# EAGLE design schema_8relay (EAGLE 7.3.0)
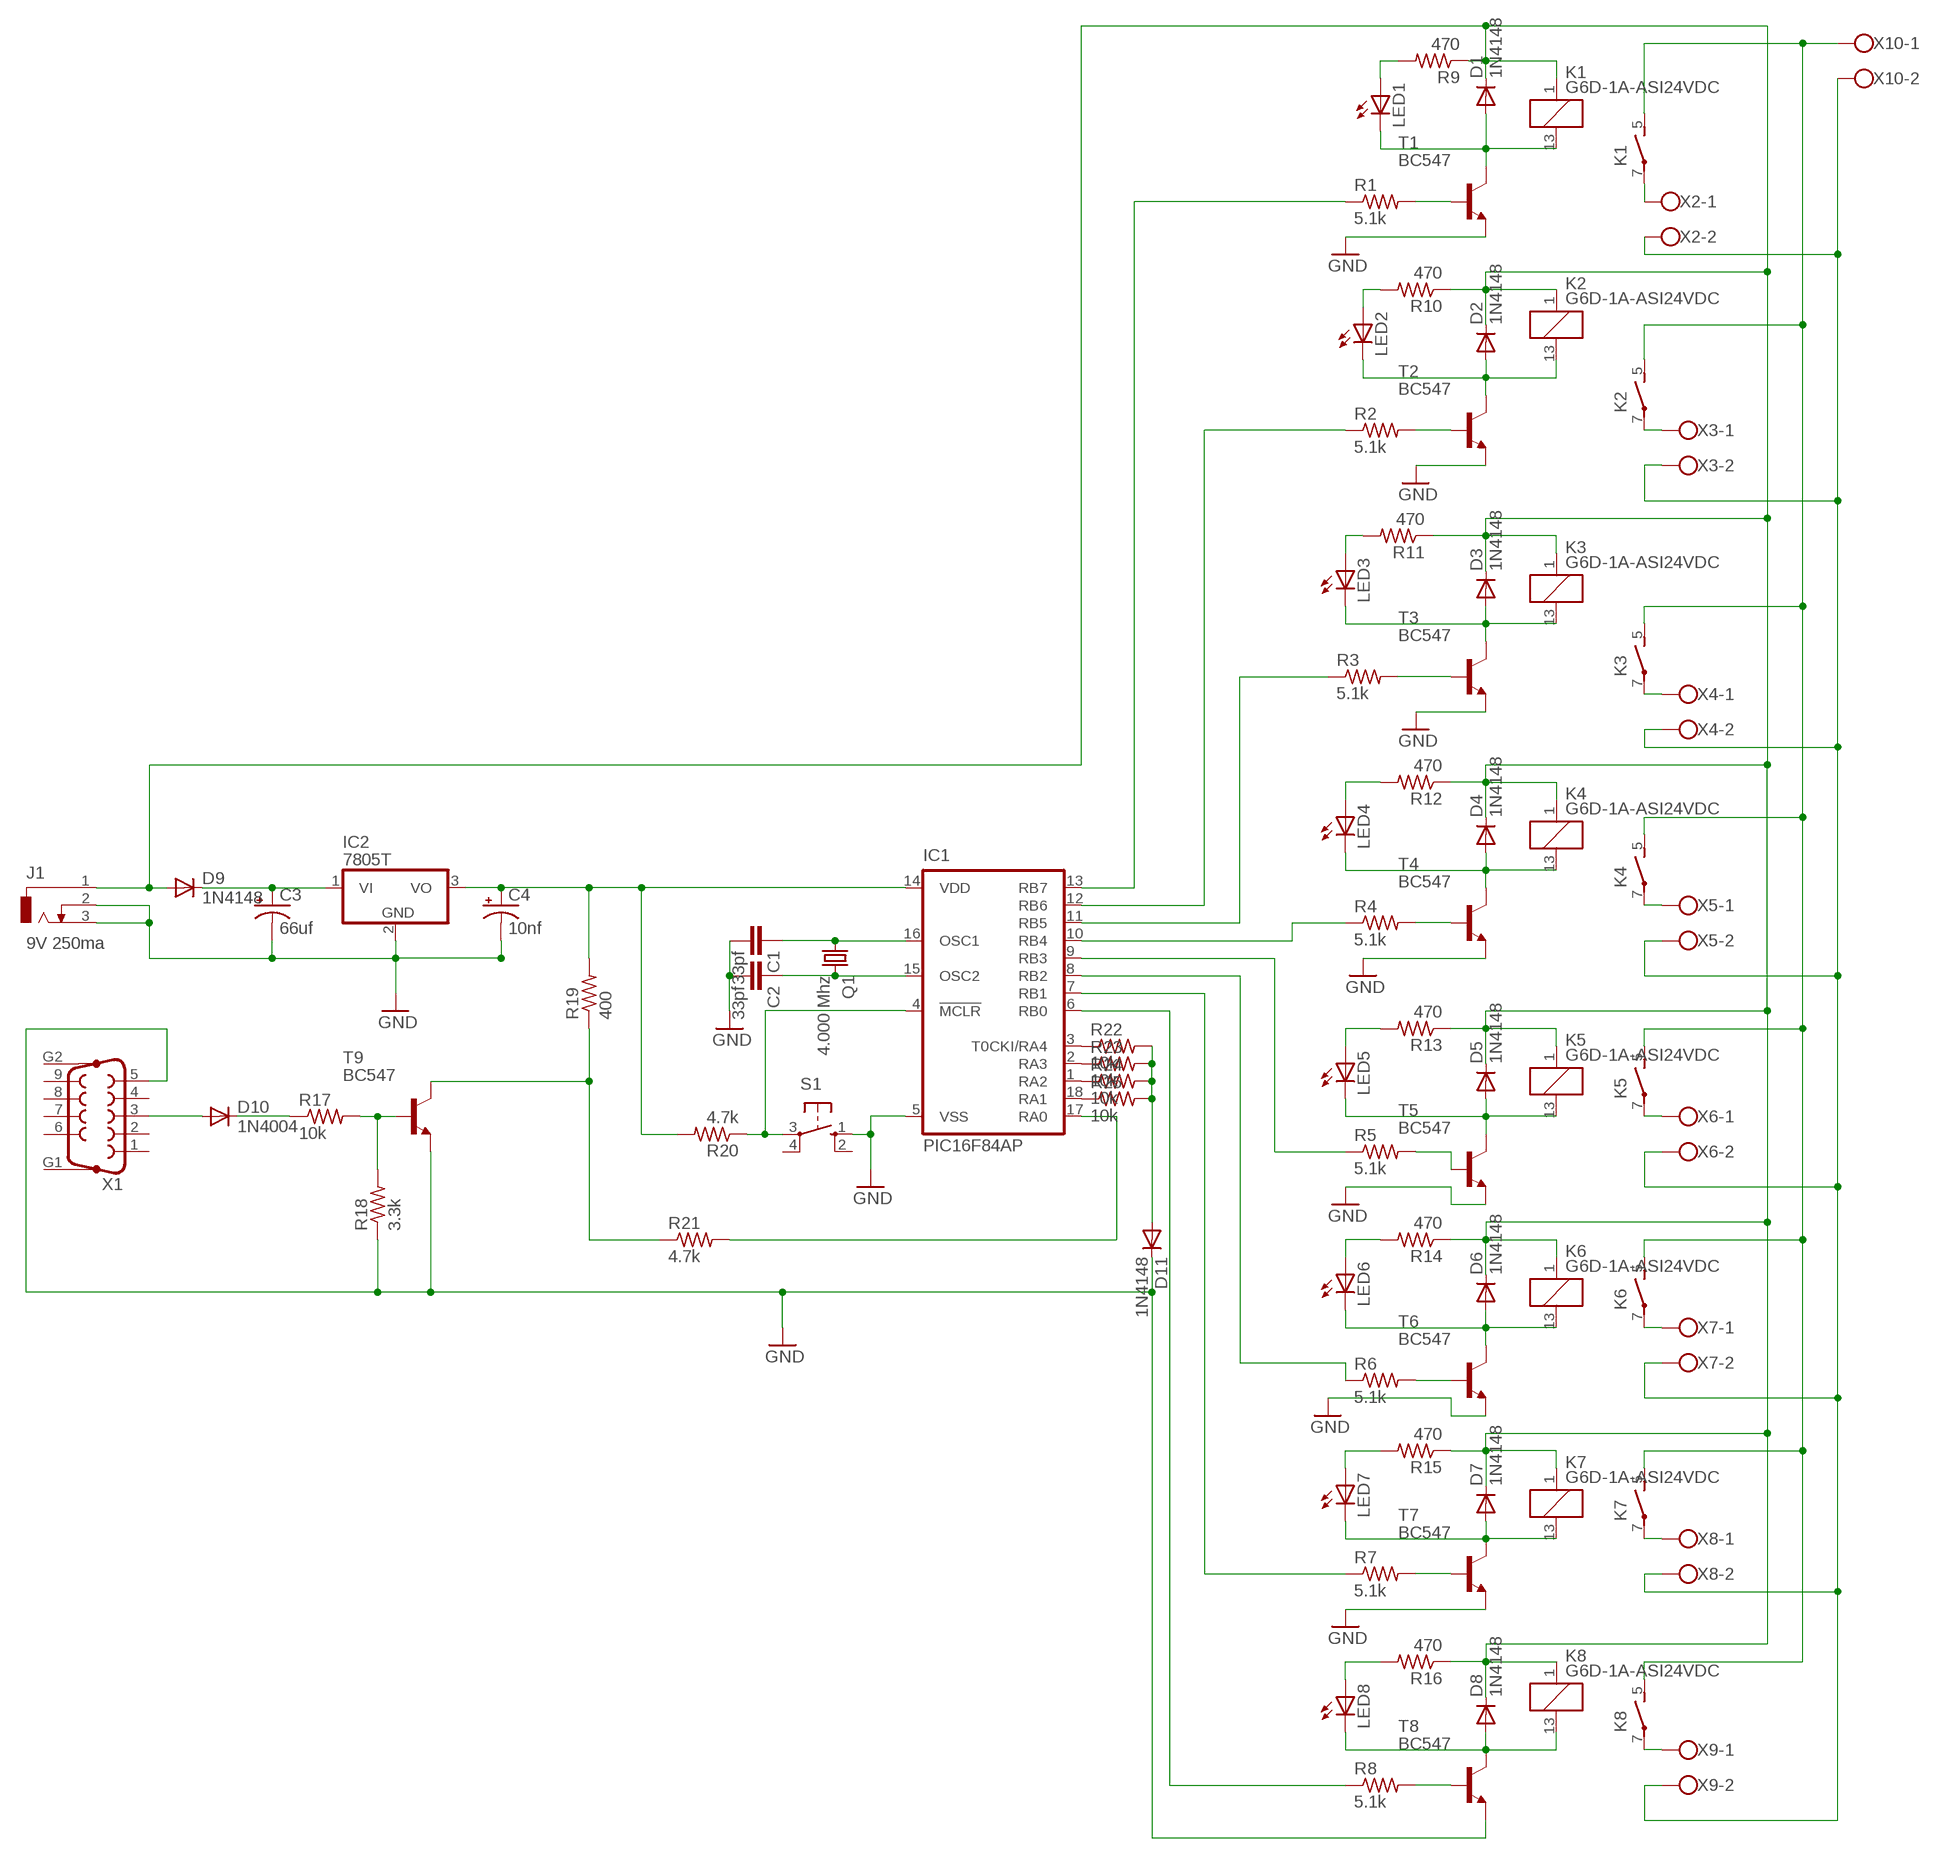
[diagram p0: schematic, sheet 1]

## Parts
C1  33pf  C-EU050-024X044  [C050-024X044]
C2  33pf  C-EU050-024X044  [C050-024X044]
C3  66uf  CPOL-USE2.5-6  [E2,5-6]
C4  10nf  CPOL-USE2.5-6  [E2,5-6]
D1  1N4148  [DO35-10]
D2  1N4148  [DO35-10]
D3  1N4148  [DO35-10]
D4  1N4148  [DO35-10]
D5  1N4148  [DO35-10]
D6  1N4148  [DO35-10]
D7  1N4148  [DO35-10]
D8  1N4148  [DO35-10]
D9  1N4148  [DO35-10]
D10  1N4004  [DO41-10]
D11  1N4148  [DO35-10]
IC1  PIC16F84AP  [DIL18]
IC2  7805T  [TO220H]
J1  9V 250ma  DCJ0303  [DCJ0303]
K1  G6D-1A-ASI24VDC  [G6D]
K2  G6D-1A-ASI24VDC  [G6D]
K3  G6D-1A-ASI24VDC  [G6D]
K4  G6D-1A-ASI24VDC  [G6D]
K5  G6D-1A-ASI24VDC  [G6D]
K6  G6D-1A-ASI24VDC  [G6D]
K7  G6D-1A-ASI24VDC  [G6D]
K8  G6D-1A-ASI24VDC  [G6D]
LED1  LED3MM  [LED3MM]
LED2  LED3MM  [LED3MM]
LED3  LED3MM  [LED3MM]
LED4  LED3MM  [LED3MM]
LED5  LED3MM  [LED3MM]
LED6  LED3MM  [LED3MM]
LED7  LED3MM  [LED3MM]
LED8  LED3MM  [LED3MM]
Q1  4.000 Mhz  CRYSTALHC49U70  [HC49U70]
R1  5.1k  R-US_0204/7  [0204/7]
R2  5.1k  R-US_0204/7  [0204/7]
R3  5.1k  R-US_0204/7  [0204/7]
R4  5.1k  R-US_0204/7  [0204/7]
R5  5.1k  R-US_0204/7  [0204/7]
R6  5.1k  R-US_0204/7  [0204/7]
R7  5.1k  R-US_0204/7  [0204/7]
R8  5.1k  R-US_0204/7  [0204/7]
R9  470  R-US_0204/7  [0204/7]
R10  470  R-US_0204/7  [0204/7]
R11  470  R-US_0204/7  [0204/7]
R12  470  R-US_0204/7  [0204/7]
R13  470  R-US_0204/7  [0204/7]
R14  470  R-US_0204/7  [0204/7]
R15  470  R-US_0204/7  [0204/7]
R16  470  R-US_0204/7  [0204/7]
R17  10k  R-US_0204/7  [0204/7]
R18  3.3k  R-US_0204/7  [0204/7]
R19  400  R-US_0207/12  [0207/12]
R20  4.7k  R-US_0204/7  [0204/7]
R21  4.7k  R-US_0204/7  [0204/7]
R22  10k  R-US_0204/7  [0204/7]
R23  10k  R-US_0204/7  [0204/7]
R24  10k  R-US_0204/7  [0204/7]
R25  10k  R-US_0204/7  [0204/7]
S1  10-XX  [B3F-10XX]
T1  BC547  [TO92]
T2  BC547  [TO92]
T3  BC547  [TO92]
T4  BC547  [TO92]
T5  BC547  [TO92]
T6  BC547  [TO92]
T7  BC547  [TO92]
T8  BC547  [TO92]
T9  BC547  [TO92]
X1  F09HP  [F09HP]
X2  W237-102  [W237-102]
X3  W237-102  [W237-102]
X4  W237-102  [W237-102]
X5  W237-102  [W237-102]
X6  W237-102  [W237-102]
X7  W237-102  [W237-102]
X8  W237-102  [W237-102]
X9  W237-102  [W237-102]
X10  W237-102  [W237-102]

## Nets
GND: C1.2 C2.2 C3.- C4.- D11.C IC1.5(VSS) IC2.2(GND) J1.2 J1.3 R18.1 S1.1(S) T1.1(E) T2.1(E) T3.1(E) T4.1(E) T5.1(E) T6.1(E) T7.1(E) T8.1(E) T9.1(E) X1.5
N$1: C1.1 IC1.16(OSC1) Q1.1
N$2: C2.1 IC1.15(OSC2) Q1.2
N$3: R19.1 R21.1 T9.3(C)
N$4: D1.A K1.13 LED1.K(C) T1.3(C)
N$5: R1.2 T1.2(B)
N$6: D2.A K2.13 LED2.K(C) T2.3(C)
N$7: IC1.17(RA0) R21.2
N$8: IC1.4(!MCLR) R20.1 S1.3(P)
N$9: D10.A X1.3
N$10: D10.C R17.1
N$11: R17.2 R18.2 T9.2(B)
N$12: C4.+ IC1.14(VDD) IC2.3(VO) R19.2 R20.2
N$13: IC1.13(RB7) R1.1
N$14: K1.7(2:P) X2.1
N$15: R2.2 T2.2(B)
N$16: LED2.A R10.2
N$17: D4.A K4.13 LED4.K(C) T4.3(C)
N$18: D6.A K6.13 LED6.K(C) T6.3(C)
N$19: LED4.A R12.2
N$20: K2.7(2:P) X3.1
N$21: IC1.10(RB4) R4.1
N$22: R3.2 T3.2(B)
N$23: R5.2 T5.2(B)
N$24: LED5.A R13.2
N$25: K3.7(2:P) X4.1
N$26: IC1.9(RB3) R5.1
N$27: R4.2 T4.2(B)
N$28: LED6.A R14.2
N$29: LED3.A R11.2
N$30: K4.7(2:P) X5.1
N$31: K1.5(2:S) K2.5(2:S) K3.5(2:S) K4.5(2:S) K5.5(2:S) K6.5(2:S) K7.5(2:S) K8.5(2:S) X10.1
N$34: C3.+ D9.C IC2.1(VI)
N$35: K5.7(2:P) X6.1
N$36: IC1.3(T0CKI/RA4) R22.1
N$37: R6.2 T6.2(B)
N$39: IC1.2(RA3) R23.1
N$40: K6.7(2:P) X7.1
N$41: IC1.1(RA2) R24.1
N$42: R7.2 T7.2(B)
N$43: D7.A K7.13 LED7.K(C) T7.3(C)
N$44: IC1.18(RA1) R25.1
N$45: K7.7(2:P) X8.1
N$46: D5.A K5.13 LED5.K(C) T5.3(C)
N$47: R8.2 T8.2(B)
N$48: LED8.A R16.2
N$49: LED7.A R15.2
N$50: K8.7(2:P) X9.1
N$52: IC1.6(RB0) R8.1
N$53: IC1.7(RB1) R7.1
N$54: IC1.8(RB2) R6.1
N$55: D8.A K8.13 LED8.K(C) T8.3(C)
N$56: LED1.A R9.2
N$57: IC1.11(RB5) R3.1
N$58: IC1.12(RB6) R2.1
N$62: X2.2 X3.2 X4.2 X5.2 X6.2 X7.2 X8.2 X9.2 X10.2
N$64: D1.C D2.C D3.C D4.C D5.C D6.C D7.C D8.C D9.A J1.1 K1.1 K2.1 K3.1 K4.1 K5.1 K6.1 K7.1 K8.1 R9.1 R10.1 R11.1 R12.1 R13.1 R14.1 R15.1 R16.1
N$69: D3.A K3.13 LED3.K(C) T3.3(C)
N$74: D11.A R22.2 R23.2 R24.2 R25.2
Unconnected: S1.2(S1) S1.4(P1) X1.1 X1.2 X1.4 X1.6 X1.7 X1.8 X1.9 X1.G1 X1.G2

## Library data of the parts
C1 C2 = rcl:C-EU: CAPACITOR, European symbol
C3 C4 = rcl:CPOL-US: POLARIZED CAPACITOR, American symbol
D1-D9 D11 = diode:1N4148: DIODE high speed (Philips)
D10 = diode:1N4004: DIODE general purpose rectifier, 1 A
IC1 = microchip:PIC16F8*: MICROCONTROLLER 8-Bit PIC16F8X Family - CMOS Flash/EEPROM Pin Compatible : PIC16F83, PIC16CR83, PIC16F84A, PIC16CR84 see also PIC16C*
IC2 = linear:78*: Positive VOLTAGE REGULATOR Source: http://cache.national.com/ds/LM/LM78L05.pdf http://www.fairchildsemi.com/ds/LM/LM7805.pdf
J1 = con-jack:DCJ0303: DC POWER JACK Source: DCJ0303.pdf
K1-K8 = relay:G6D?*: OMRON Slim, Miniature PCB Relay 17.5 × 6.5 × 12.5 mm with Socked Source: http://ecb.omron.com.sg/pdf/relay/power/G6D.pdf
LED1-LED8 = led:LED: LED OSRAM: - CHIPLED LG R971, LG N971, LY N971, LG Q971, LY Q971, LO R971, LY R971 LH N974, LH R974 LS Q976, LO Q976, LY Q976 LO Q996 - Hyper CHIPLED LW Q18S LB Q993, LB Q99A, LB R99A - SideLED LS A670, LO A670, LY A670, LG A670, LP A670 LB A673, LV A673, LT A673, LW A673 LH A674 LY A675 LS A676, LA A676, LO A676, LY A676, LW A676 LS A679, LY A679, LG A679 - Hyper Micro SIDELED® LS Y876, LA Y876, LO Y876, LY Y876 LT Y87S - SmartLED LW L88C, LW L88S LB L89C, LB L89S, LG L890 LS L89K, LO L89K, LY L89K LS L896, LA L896, LO L896, LY L896 - TOPLED LS T670, LO T670, LY T670, LG T670, LP T670 LSG T670, LSP T670, LSY T670, LOP T670, LYG T670 LG T671, LOG T671, LSG T671 LB T673, LV T673, LT T673, LW T673 LH T674 LS T676, LA T676, LO T676, LY T676, LB T676, LH T676, LSB T676, LW T676 LB T67C, LV T67C, LT T67C, LS T67K, LO T67K, LY T67K, LW E67C LS E67B, LA E67B, LO E67B, LY E67B, LB E67C, LV E67C, LT E67C LW T67C LS T679, LY T679, LG T679 LS T770, LO T770, LY T770, LG T770, LP T770 LB T773, LV T773, LT T773, LW T773 LH T774 LS E675, LA E675, LY E675, LS T675 LS T776, LA T776, LO T776, LY T776, LB T776 LHGB T686 LT T68C, LB T68C - Hyper Mini TOPLED® LB M676 - Mini TOPLED Santana® LG M470 LS M47K, LO M47K, LY M47K Source: http://www.osram.convergy.de - LUMILED® LXK2-PW12-R00, LXK2-PW12-S00, LXK2-PW14-U00, LXK2-PW14-V00 LXK2-PM12-R00, LXK2-PM12-S00, LXK2-PM14-U00 LXK2-PE12-Q00, LXK2-PE12-R00, LXK2-PE12-S00, LXK2-PE14-T00, LXK2-PE14-U00 LXK2-PB12-K00, LXK2-PB12-L00, LXK2-PB12-M00, LXK2-PB14-N00, LXK2-PB14-P00, LXK2-PB14-Q00 LXK2-PR12-L00, LXK2-PR12-M00, LXK2-PR14-Q00, LXK2-PR14-R00 LXK2-PD12-Q00, LXK2-PD12-R00, LXK2-PD12-S00 LXK2-PH12-R00, LXK2-PH12-S00 LXK2-PL12-P00, LXK2-PL12-Q00, LXK2-PL12-R00 Source: www.luxeon.com
Q1 = crystal:CRYSTAL: CRYSTAL
R1-R25 = rcl:R-US_: RESISTOR, American symbol
S1 = switch-omron:10-XX: OMRON SWITCH
T1-T9 = transistor:BC547: NPN TRANSISTOR
X1 = con-subd:F09HP: SUB-D
X2-X10 = con-wago-500:W237-102: WAGO SCREW CLAMP

## Board
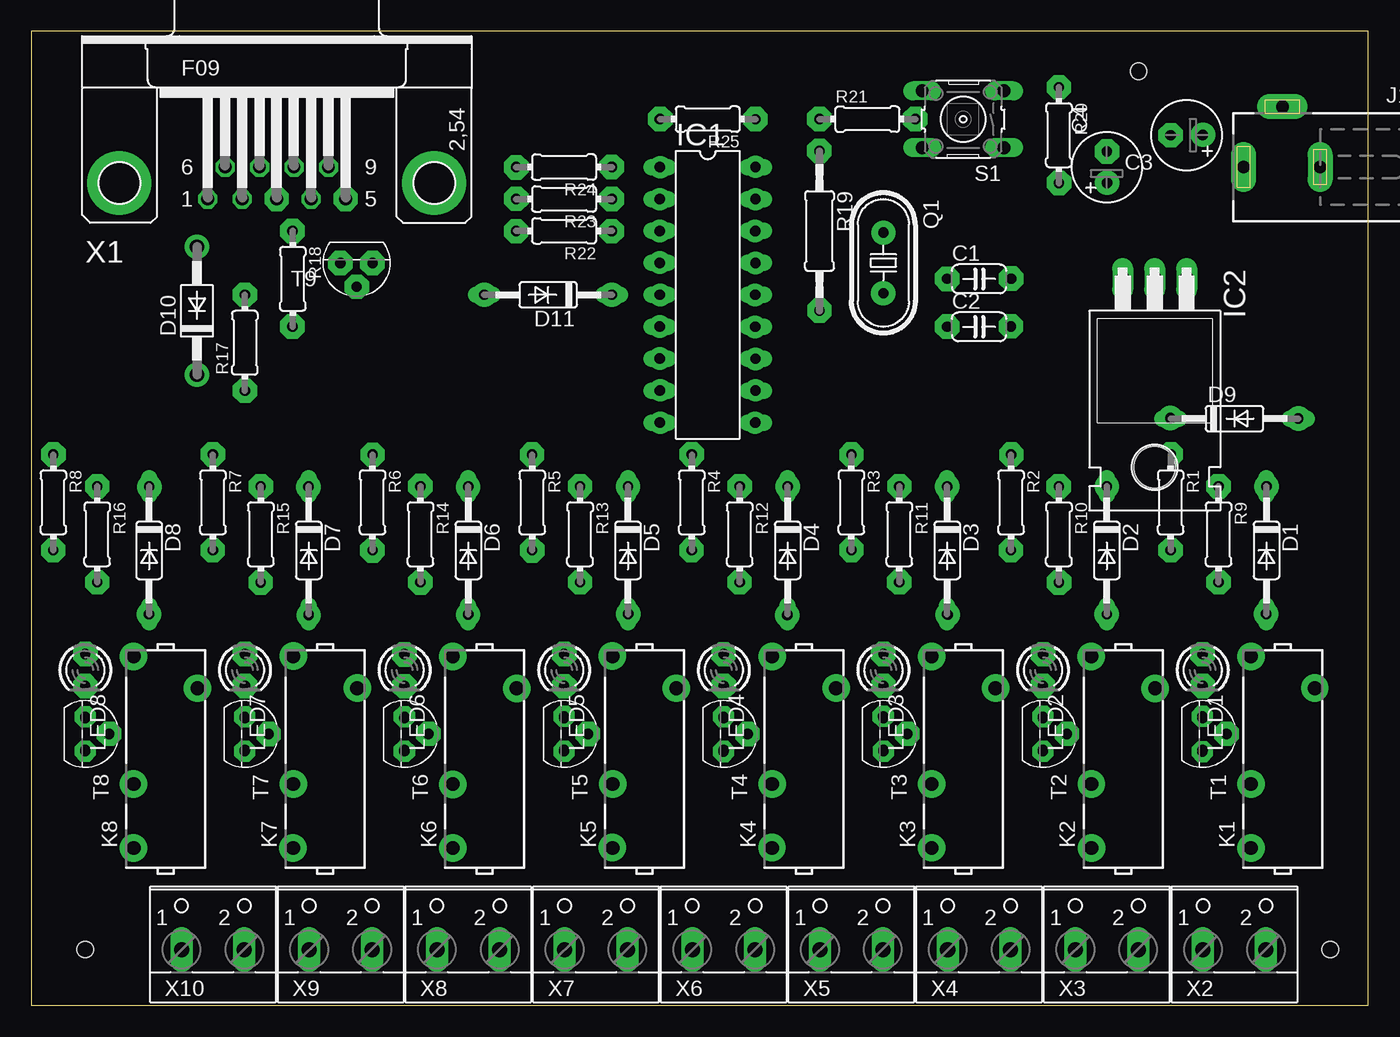
[diagram p1: board, top side]
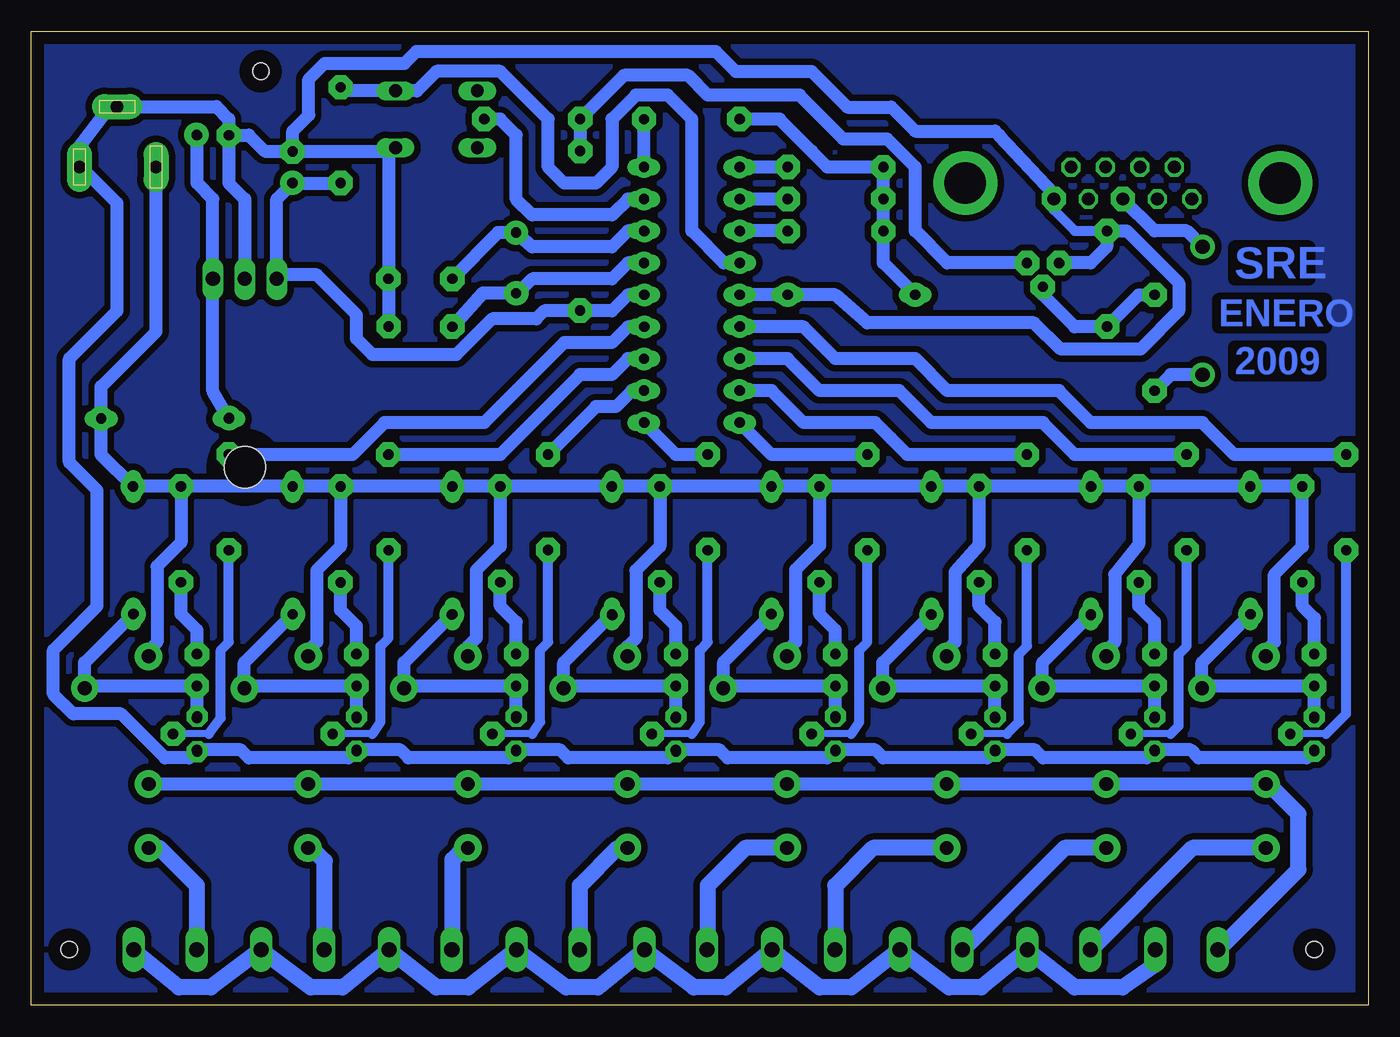
[diagram p2: board, bottom side, seen from below]

Size 106.35 x 77.46 mm. Coordinates in mm from the lower left corner, seen from the top.
Outline: 0,0 106.35,0 106.35,77.46 0,77.46 0,0
Copper layers (1*16): Top 0.035mm / dielectric 1.5mm / Bottom 0.035mm
Design rules "default": minimum track width 10mil, minimum drill 24mil, track to track 8mil, track to pad 8mil, pad to pad 8mil, via to via 8mil, smd to smd 8mil, copper to edge 40mil, drill to drill 8mil, minimum pad ring 10mil, minimum via ring 8mil, stop-mask expansion 4mil, vias tented up to drill 0mil, thermal gap 10mil
Holes 1.3 mm at 88.1,74.29 4.28,4.44 103.34,4.44

### Footprints (pad centres in the part's own frame; a part is rotated, then mirrored left to right if it is on the bottom)
C050-024X044 = drill 0.813 octagon: 1 -2.54,0; 2 2.54,0
E2,5-6 = drill 0.813 pad 1.6: + -1.27,0 | drill 0.813 pad 1.6 octagon: - 1.27,0
DO35-10 = drill 0.813 long: A 5.08,0; C -5.08,0
DO41-10 = drill 1.118: A 5.08,0; C -5.08,0
DIL18 = drill 0.813 long: 1 -10.16,-3.81; 2 -7.62,-3.81; 3 -5.08,-3.81; 4 -2.54,-3.81; 5 0,-3.81; 6 2.54,-3.81; 7 5.08,-3.81; 8 7.62,-3.81; 9 10.16,-3.81; 10 10.16,3.81; 11 7.62,3.81; 12 5.08,3.81; 13 2.54,3.81; 14 0,3.81; 15 -2.54,3.81; 16 -5.08,3.81; 17 -7.62,3.81; 18 -10.16,3.81
TO220H = drill 1.118 long: 1 -2.54,-10.16; 2 0,-10.16; 3 2.54,-10.16 | hole 3.302: 0,4.826
DCJ0303 = drill 1 pad 2 long: 1 0,3.1; 2 4.8,0; 3 0,-3
G6D = drill 1.1 pad 1.676: 1 8.08,2.5; 5 -2.08,2.5; 7 -7.16,2.5; 13 5.54,-2.58
LED3MM = drill 0.813 octagon: A -1.27,0; K 1.27,0
HC49U70 = drill 0.813: 1 -2.413,0; 2 2.413,0
0204/7 = drill 0.813 octagon: 1 -3.81,0; 2 3.81,0
0207/12 = drill 0.813 octagon: 1 -6.35,0; 2 6.35,0
B3F-10XX = drill 1.016 long: 1 -3.251,2.261; 2 3.251,2.261; 3 -3.251,-2.261; 4 3.251,-2.261
TO92 = drill 0.813 octagon: 1 1.27,0; 2 0,1.905; 3 -1.27,0
F09HP = drill 1.016 octagon: 1 -5.486,-1.27; 2 -2.743,-1.27; 3 0,-1.27; 4 2.743,-1.27; 5 5.486,-1.27; 6 -4.115,1.27; 7 -1.372,1.27; 8 1.372,1.27; 9 4.115,1.27 | drill 3.302 pad 5.08: G1 -12.522,0; G2 12.522,0
W237-102 = drill 1.194 long: 1 -2.5,-1.27; 2 2.5,-1.27

### Placement (x,y rotation side)
C1  75.4,57.78 0 top
C2  75.4,53.97 0 top
C3  91.91,69.21 180 top
C4  85.56,66.67 90 top
D1  98.26,36.19 270 top
D2  85.56,36.19 270 top
D3  72.86,36.19 270 top
D4  60.16,36.19 270 top
D5  47.46,36.19 270 top
D6  34.76,36.19 270 top
D7  22.06,36.19 270 top
D8  9.36,36.19 270 top
D9  95.72,46.67 0 top
D10  13.17,55.24 90 top
D11  41.11,56.51 180 top
IC1  53.81,56.51 270 top
IC2  89.37,47.62 180 top
J1  99.53,66.67 90 top
K1  99.53,19.68 90 top
K2  86.83,19.68 90 top
K3  74.13,19.68 90 top
K4  61.43,19.68 90 top
K5  48.73,19.68 90 top
K6  36.03,19.68 90 top
K7  23.33,19.68 90 top
K8  10.63,19.68 90 top
LED1  93.18,26.66 270 top
LED2  80.48,26.66 270 top
LED3  67.78,26.66 270 top
LED4  55.08,26.66 270 top
LED5  42.38,26.66 270 top
LED6  29.68,26.66 270 top
LED7  16.98,26.66 270 top
LED8  4.28,26.66 270 top
Q1  67.78,59.05 270 top
R1  90.64,40 270 top
R2  77.94,40 270 top
R3  65.24,40 270 top
R4  52.54,40 270 top
R5  39.84,40 270 top
R6  27.14,40 270 top
R7  14.44,40 270 top
R8  1.74,40 270 top
R9  94.45,37.46 270 top
R10  81.75,37.46 270 top
R11  69.05,37.46 270 top
R12  56.35,37.46 270 top
R13  43.65,37.46 270 top
R14  30.95,37.46 270 top
R15  18.25,37.46 270 top
R16  5.23,37.46 270 top
R17  16.98,52.7 90 top
R18  20.79,57.78 270 top
R19  62.7,61.59 270 top
R20  81.75,69.21 270 top
R21  66.51,70.48 0 top
R22  42.38,61.59 180 top
R23  42.38,64.13 180 top
R24  42.38,66.67 180 top
R25  53.81,70.48 180 top
S1  74.13,70.48 180 top
T1  93.18,21.58 270 top
T2  80.48,21.58 270 top
T3  67.78,21.58 270 top
T4  55.08,21.58 270 top
T5  42.38,21.58 270 top
T6  29.68,21.58 270 top
T7  16.98,21.58 270 top
T8  4.28,21.58 270 top
T9  25.87,59.05 180 top
X1  19.52,65.4 0 top
X2  95.72,5.71 0 top
X3  85.56,5.71 0 top
X4  75.4,5.71 0 top
X5  65.24,5.71 0 top
X6  55.08,5.71 0 top
X7  44.92,5.71 0 top
X8  34.76,5.71 0 top
X9  24.6,5.71 0 top
X10  14.44,5.71 0 top

### Tracks (layer width: path | path; a pad name or v marks a point on that pad's centre or on a via)
GND
  Bottom 0.406: 25.01,64.54 X1.5 | 102.7,66.67 J1.3 102.39,66.67 | S1.1 77.58,68.22 77.62,68.26 77.94,67.94
  Bottom 0.813: R18.1 23.33,61.59 25.01,63.27 X1.5
  Bottom 1.016: IC1.5 D11.C 42.38,56.51 39.84,54.29 26.58,54.29 24.44,52.18 18.09,52.18 15.08,55.24 15.08,57.46 19.2,61.59 R18.1 20.79,60.32 22.06,59.05 T9.1 | J1.3 102.74,68.06 100.16,71.43 J1.2 91.63,71.47 90.64,70.48 C3.- | C2.2 C1.2 77.94,67.94 C4.- | IC2.2 89.37,64.13 90.64,65.4 C3.- | 25.01,64.54 29.36,69.21 29.68,69.53 36.03,69.53 37.94,71.43 41.43,71.43 44.29,74.29 50.32,74.29 51.91,75.88 75.72,75.88 76.67,74.92 83.02,74.92 84.29,73.66 84.29,70.8 85.56,69.53 C4.- | T8.1 4.92,19.68 13.49,19.68 14.12,20.31 T7.1 17.61,19.68 25.87,19.68 26.5,20.31 T6.1 30.31,19.68 38.57,19.68 39.21,20.31 T5.1 43.02,19.68 50.95,19.68 51.59,20.31 T4.1 55.72,19.68 63.65,19.68 64.29,20.31 T3.1 68.41,19.68 76.35,19.68 76.99,20.31 T2.1 81.11,19.68 89.05,19.68 89.69,20.31 T1.1 93.81,19.68 95.72,19.68 99.21,23.17 103.02,23.17 104.61,24.76 104.61,28.25 101.12,31.74 101.12,40.95 103.34,43.18 103.34,51.43 99.53,55.24 99.53,63.81 102.39,66.67 | C3.- 89.05,69.21 87.78,67.94 C4.-
N$1
  Bottom 1.016: IC1.16 58.89,61.59 60.16,60.32 66.51,60.32 Q1.1 69.24,61.46 C1.1
N$2
  Bottom 0.406: 67.78,56.51 Q1.2
  Bottom 1.016: IC1.15 58.89,59.05 60.16,57.78 66.51,57.78 67.78,56.51 | Q1.2 70.45,56.64 C2.1
N$3
  Bottom 1.016: R19.1 R21.1 59.21,73.97 54.13,73.97 52.54,72.38 45.24,72.38 41.75,68.89 38.25,68.89 36.03,66.67 36.03,61.59 33.49,59.05 T9.3
N$4
  Bottom 0.406: K1.13 102.11,25.36 102.07,25.39 102.11,25.43
  Bottom 1.016: T1.3 LED1.K 102.07,25.39 | D1.A 102.11,27.26 102.11,25.43
N$5
  Bottom 0.56: 92.23,21.58 T1.2
  Bottom 0.813: 92.23,21.58 91.27,22.86 91.27,28.25 90.64,28.89 R1.2
N$6
  Bottom 0.406: K2.13 89.41,25.36 89.37,25.39 89.41,25.43
  Bottom 1.016: T2.3 LED2.K 89.37,25.39 | D2.A 89.41,27.26 89.41,25.43
N$7
  Bottom 1.016: R21.2 69.05,70.48 67.78,69.21 67.78,64.13 66.51,62.86 60.16,62.86 58.89,64.13 IC1.17
N$8
  Bottom 1.016: IC1.4 51.27,59.05 53.81,61.59 53.81,70.48 55.72,72.38 58.26,72.38 60.16,70.48 60.16,66.67 61.43,65.4 63.97,65.4 65.24,66.67 65.24,70.48 69.05,74.29 74.13,74.29 75.68,72.74 S1.3 81.47,72.74 R20.1
N$9
  Bottom 1.016: X1.3 16.98,61.59 14.44,61.59 D10.A
N$10
  Bottom 1.016: D10.C 15.71,50.16 R17.1
N$11
  Bottom 1.016: T9.2 25.87,56.51 23.33,53.97 R18.2 18.25,56.51 R17.2
N$12
  Bottom 0.406: 86.19,58.1 IC2.3
  Bottom 1.016: IC1.14 58.89,56.51 60.16,55.24 R19.2 65.56,55.24 66.19,54.61 69.68,54.61 72.54,51.75 79.21,51.75 80.48,53.02 80.48,54.92 83.66,58.1 86.19,58.1 | IC2.3 86.83,64.13 C4.+ R20.2
N$13
  Bottom 1.016: R1.1 87.78,43.81 80.8,43.81 78.26,46.35 70.32,46.35 63.97,52.7 60.16,52.7 58.89,53.97 IC1.13
N$14
  Bottom 0.406: X2.1 93.18,4.44
  Bottom 1.27: K1.7 96.18,12.52 93.18,9.52 93.18,4.44
N$15
  Bottom 0.56: 79.21,21.58 T2.2
  Bottom 0.813: 79.21,21.58 78.57,22.54 78.57,28.57 77.94,29.2 R2.2
N$16
  Bottom 1.016: LED2.A 80.48,30.16 81.75,31.43 R10.2
N$17
  Bottom 0.406: K4.13 64.01,25.36 63.97,25.39
  Bottom 1.016: T4.3 LED4.K 63.97,25.39 | K4.13 64.01,27.26 D4.A
N$18
  Bottom 0.406: 38.57,25.39 38.61,25.36 K6.13
  Bottom 1.016: K6.13 38.61,27.26 D6.A | T6.3 LED6.K 38.57,25.39
N$19
  Bottom 1.016: LED4.A 55.08,30.16 56.35,31.43 R12.2
N$20
  Bottom 0.406: X3.1 83.02,4.44
  Bottom 1.27: K2.7 83.92,12.36 83.02,11.47 83.02,4.44
N$21
  Bottom 1.016: R4.1 55.08,43.81 IC1.10
N$22
  Bottom 0.56: 66.51,21.58 T3.2
  Bottom 0.813: 66.51,21.58 65.88,22.54 65.88,28.25 65.24,28.89 R3.2
N$23
  Bottom 0.56: 41.11,21.58 T5.2
  Bottom 0.813: 41.11,21.58 40.48,22.54 40.48,28.25 39.84,28.89 R5.2
N$24
  Bottom 1.016: R13.2 43.65,31.11 42.38,29.84 LED5.A
N$25
  Bottom 0.406: X4.1 72.86,4.44 | 71.91,12.54 71.89,12.52 K3.7
  Bottom 1.27: 72.86,4.44 72.86,11.58 71.91,12.54
N$26
  Bottom 1.016: R5.1 47.46,43.81 IC1.9
N$27
  Bottom 0.56: 53.81,21.58 T4.2
  Bottom 0.813: 53.81,21.58 53.18,22.54 53.18,28.25 52.54,28.89 R4.2
N$28
  Bottom 1.016: R14.2 30.95,31.74 29.68,30.47 29.68,28.57 LED6.A
N$29
  Bottom 1.016: LED3.A 67.78,28.57 67.78,30.47 69.05,31.74 R11.2
N$30
  Bottom 0.406: X5.1 62.7,4.44
  Bottom 1.27: K4.7 59.7,12.52 62.7,9.52 62.7,4.44
N$31
  Bottom 0.406: X10.1 11.9,4.44 | K7.5 20.65,17.6 20.63,17.62 20.61,17.6 | K6.5 33.63,17.6 33.65,17.62 | K5.5 46.21,17.6 46.19,17.62 46.17,17.6 | K4.5 58.93,17.5 58.89,17.46 58.75,17.6 | K3.5 71.61,17.6 71.43,17.77 71.26,17.6 | K2.5 84.15,17.6 84.13,17.62 84.11,17.6 | K1.5 96.85,17.6 96.83,17.62 96.81,17.6
  Bottom 1.016: K8.5 20.61,17.6 | K7.5 K6.5 46.17,17.6 | K5.5 58.75,17.6 | K4.5 71.26,17.6 | K3.5 84.11,17.6 | K2.5 96.81,17.6
  Bottom 1.27: K8.5 7.92,17.6 5.55,15.24 5.55,10.79 11.9,4.44
N$32  (via drill 0.8 pad 1.93)
  other vias: 1.73,36.2
N$33  (via drill 0.8 pad 1.93)
  other vias: 5.24,33.65
N$34
  Bottom 1.016: D9.C 91.91,48.85 IC2.1 91.91,64.13 93.18,65.4 C3.+
N$35
  Bottom 0.406: 52.54,4.44 X6.1
  Bottom 1.27: K5.7 49.54,12.52 52.54,9.52 52.54,4.44
N$36
  Bottom 1.016: R22.1 IC1.3
N$37
  Bottom 0.56: 28.73,21.58 T6.2
  Bottom 0.813: 28.73,21.58 27.77,22.54 27.77,27.93 27.14,28.57 R6.2
N$38  (via drill 0.8 pad 1.93)
  other vias: 4.29,27.94
N$39
  Bottom 1.016: R23.1 IC1.2
N$40
  Bottom 0.406: 42.38,4.44 X7.1
  Bottom 1.27: K6.7 39.38,12.52 42.38,9.52 42.38,4.44
N$41
  Bottom 1.016: R24.1 IC1.1
N$42
  Bottom 0.56: 15.71,21.58 T7.2
  Bottom 0.813: R7.2 14.44,28.57 15.08,27.93 15.08,22.22 15.71,21.58
N$43
  Bottom 0.406: 25.55,25.39 25.55,25.22 K7.13
  Bottom 1.016: T7.3 LED7.K 25.55,25.39 | K7.13 25.91,27.26 D7.A
N$44
  Bottom 1.016: IC1.18 R25.1
N$45
  Bottom 0.406: 32.22,4.44 X8.1
  Bottom 1.27: K7.7 24.14,12.52 32.22,4.44
N$46
  Bottom 0.406: 51.27,25.39 51.31,25.36 K5.13
  Bottom 1.016: T5.3 LED5.K 51.27,25.39 51.27,27.3 D5.A
N$47  (via drill 0.8 pad 1.68)
  Bottom 0.406: v1.74,36.18 1.74,35.98 1.7,35.95 1.74,35.91 | v1.74,36.18 R8.2 | v1.74,36.18 1.74,36.14 1.78,36.1
  Bottom 0.56: 3.33,21.58 T8.2
  Bottom 0.813: 3.33,21.58 1.74,23.17 1.74,35.91
N$48
  Bottom 1.016: LED8.A 4.28,30.79 5.23,31.74 R16.2
N$49
  Bottom 1.016: LED7.A 16.98,30.47 18.25,31.74 R15.2
N$50
  Bottom 0.406: 22.06,4.44 X9.1
  Bottom 1.27: K8.7 13.98,12.52 22.06,4.44
N$51  (via drill 0.8 pad 1.93)
  other vias: 4.29,25.39
N$52
  Bottom 1.016: R8.1 10.63,43.81 13.17,46.35 22.06,46.35 24.6,48.89 33.49,48.89 36.03,51.43 42.38,51.43 44.92,53.97 IC1.6
N$53
  Bottom 1.016: R7.1 23.33,43.81 25.87,46.35 34.76,46.35 37.3,48.89 43.65,48.89 46.19,51.43 IC1.7
N$54
  Bottom 1.016: R6.1 36.66,43.81 37.94,45.08 39.21,46.35 44.92,46.35 47.46,48.89 IC1.8
N$55
  Bottom 0.406: 12.85,25.39 13.03,25.22 K8.13 13.21,25.36 13.17,25.39 13.21,25.43
  Bottom 1.016: T8.3 LED8.K 12.85,25.39 | 13.21,25.43 13.21,27.26 D8.A
N$56
  Bottom 1.016: LED1.A 93.18,29.84 94.45,31.11 R9.2
N$57
  Bottom 1.016: IC1.11 58.57,48.89 59.84,47.62 61.43,47.62 R3.1
N$58
  Bottom 1.016: R2.1 69.05,43.81 62.7,50.16 60.16,50.16 58.89,51.43 IC1.12
N$59  (via drill 0.8 pad 1.93)
  other vias: 6.17,21.59
N$60  (via drill 0.8 pad 1.93)
  other vias: 18.88,21.57
N$61  (via drill 0.8 pad 1.93)
  other vias: 17,25.41
N$62
  Bottom 0.406: X10.2 16.94,3.21 | 27.14,4.44 X9.2 | 37.3,4.44 X8.2 | 47.46,4.44 X7.2 | 57.62,4.44 X6.2 | 67.78,4.44 X5.2 | 77.94,4.44 X4.2 | 88.1,4.44 X3.2 | 98.26,4.44 X2.2
  Bottom 1.27: 16.94,3.21 19.52,1.42 23.33,1.42 27.14,4.44 30.79,1.42 33.33,1.42 37.3,4.44 41.11,1.42 43.65,1.42 47.46,4.44 51.11,1.42 53.65,1.42 57.62,4.44 61.27,1.42 63.81,1.42 67.78,4.44 71.59,1.42 74.13,1.42 77.94,4.44 81.59,1.42 84.13,1.42 88.1,4.44 92.07,1.42 94.61,1.42 98.26,4.44
N$63  (via drill 0.8 pad 1.93)
  other vias: 16.99,27.95
N$64
  Bottom 1.016: K8.1 8.13,28.21 7.46,28.89 7.46,34.29 5.23,36.51 R16.1 D8.C R15.1 | R15.1 D7.C R14.1 | R14.1 D6.C R13.1 | R13.1 D5.C R12.1 | R12.1 D4.C R11.1 | R11.1 D3.C R10.1 | R10.1 D2.C R9.1 | R9.1 D1.C 100.8,43.81 D9.A 100.8,49.21 96.43,53.58 J1.1 | K7.1 20.83,28.21 20.15,28.89 20.15,34.29 18.25,36.67 R15.1 | K1.1 97.03,28.21 96.35,28.89 96.35,34.92 94.45,36.83 R9.1 | K2.1 84.33,28.21 83.66,28.89 83.66,34.6 81.75,36.51 R10.1 | K3.1 71.63,28.53 70.95,29.2 70.95,34.6 69.05,36.51 R11.1 | K4.1 58.93,28.53 58.26,29.2 58.26,34.6 56.35,36.51 R12.1 | K5.1 46.23,28.21 45.55,28.89 45.55,34.65 43.65,36.56 R13.1 | K6.1 33.53,28.21 32.85,28.89 32.85,34.45 30.95,36.6 R14.1
N$65  (via drill 0.8 pad 1.93)
  other vias: 18.25,33.63
N$66  (via drill 0.8 pad 1.93)
  other vias: 14.42,36.2
N$67  (via drill 0.8 pad 1.93)
  other vias: 27.13,36.18
N$68  (via drill 0.8 pad 1.93)
  other vias: 30.95,33.64
N$69
  Bottom 0.406: K3.13 76.71,25.36 76.67,25.39 76.71,25.43
  Bottom 1.016: T3.3 LED3.K 76.67,25.39 | D3.A 76.71,27.26 76.71,25.43
N$70  (via drill 0.8 pad 1.93)
  other vias: 29.67,27.91
N$71  (via drill 0.8 pad 1.93)
  other vias: 29.68,25.38
N$72  (via drill 0.8 pad 1.93)
  other vias: 31.59,21.6
N$73  (via drill 0.8 pad 1.93)
  other vias: 1.75,43.81
N$74
  Bottom 1.016: R25.2 46.83,70.48 44.29,67.94 43.02,66.67 R24.2 R23.2 R22.2 38.57,59.05 D11.A
N$75  (via drill 0.8 pad 1.93)
  other vias: 5.23,41.27
N$76  (via drill 0.8 pad 1.93)
  other vias: 14.44,43.81
N$77  (via drill 0.8 pad 1.93)
  other vias: 18.25,41.27
N$78  (via drill 0.8 pad 1.93)
  other vias: 27.15,43.8
N$79  (via drill 0.8 pad 1.93)
  other vias: 30.95,41.3
N$80  (via drill 0.8 pad 1.93)
  other vias: 16.99,48.88
N$81  (via drill 0.8 pad 1.93)
  other vias: 19.52,64.14
N$82  (via drill 0.8 pad 1.93)
  other vias: 25.01,64.14
N$83  (via drill 0.8 pad 1.93)
  other vias: 20.76,61.59
N$84  (via drill 0.8 pad 1.93)
  other vias: 24.58,59.04
N$85  (via drill 0.8 pad 1.93)
  other vias: 27.13,59.04
N$86  (via drill 0.8 pad 1.93)
  other vias: 25.89,57.15
N$87  (via drill 0.8 pad 1.93)
  other vias: 38.57,66.65
N$88  (via drill 0.8 pad 1.93)
  other vias: 38.57,64.16
N$89  (via drill 0.8 pad 1.93)
  other vias: 38.56,61.57
N$90  (via drill 0.8 pad 1.93)
  other vias: 46.17,66.69
N$91  (via drill 0.8 pad 1.93)
  other vias: 46.18,64.13
N$92  (via drill 0.8 pad 1.93)
  other vias: 46.17,61.57
N$93  (via drill 0.8 pad 1.93)
  other vias: 50.02,70.49
N$94  (via drill 0.8 pad 1.93)
  other vias: 57.61,70.49
N$95  (via drill 0.8 pad 1.93)
  other vias: 62.69,70.49
N$96  (via drill 0.8 pad 1.93)
  other vias: 62.69,67.96
N$97  (via drill 0.8 pad 1.93)
  other vias: 70.32,70.49
N$98  (via drill 0.8 pad 1.93)
  other vias: 81.75,73.03
N$99  (via drill 0.8 pad 1.93)
  other vias: 90.65,69.2
N$100  (via drill 0.8 pad 1.93)
  other vias: 85.58,67.91
N$101  (via drill 0.8 pad 1.93)
  other vias: 81.76,65.41
N$102  (via drill 0.8 pad 1.93)
  other vias: 62.7,55.27
N$103  (via drill 0.8 pad 1.93)
  other vias: 72.87,53.99
N$104  (via drill 0.8 pad 1.93)
  other vias: 72.86,57.78
N$105  (via drill 0.8 pad 1.93)
  other vias: 77.95,57.8
N$106  (via drill 0.8 pad 1.93)
  other vias: 77.93,54.02
N$107  (via drill 0.8 pad 1.93)
  other vias: 65.25,43.8
N$108  (via drill 0.8 pad 1.93)
  other vias: 69.07,41.29
N$109  (via drill 0.8 pad 1.93)
  other vias: 52.54,43.81
N$110  (via drill 0.8 pad 1.93)
  other vias: 56.36,41.29
N$111  (via drill 0.8 pad 1.93)
  other vias: 77.96,43.81
N$112  (via drill 0.8 pad 1.93)
  other vias: 43.65,41.27
N$113  (via drill 0.8 pad 1.93)
  other vias: 39.83,43.81
N$114  (via drill 0.8 pad 1.93)
  other vias: 39.85,36.18
N$115  (via drill 0.8 pad 1.93)
  other vias: 43.65,33.66
N$116  (via drill 0.8 pad 1.93)
  other vias: 52.53,36.21
N$117  (via drill 0.8 pad 1.93)
  other vias: 56.34,33.66
N$118  (via drill 0.8 pad 1.93)
  other vias: 55.07,27.93
N$119  (via drill 0.8 pad 1.93)
  other vias: 55.07,25.4
N$120  (via drill 0.8 pad 1.93)
  other vias: 56.97,21.58
N$121  (via drill 0.8 pad 1.93)
  other vias: 44.27,21.59
N$122  (via drill 0.8 pad 1.93)
  other vias: 42.39,25.38
N$123  (via drill 0.8 pad 1.93)
  other vias: 42.39,27.93
N$124  (via drill 0.8 pad 1.93)
  other vias: 80.48,25.4
N$125  (via drill 0.8 pad 1.93)
  other vias: 80.5,27.93
N$126  (via drill 0.8 pad 1.93)
  other vias: 67.78,27.95
N$127  (via drill 0.8 pad 1.93)
  other vias: 67.79,25.41
N$128  (via drill 0.8 pad 1.93)
  other vias: 69.05,33.66
N$129  (via drill 0.8 pad 1.93)
  other vias: 65.24,36.22
N$130  (via drill 0.8 pad 1.93)
  other vias: 77.93,36.2
N$131  (via drill 0.8 pad 1.93)
  other vias: 81.76,33.63
N$132  (via drill 0.8 pad 1.93)
  other vias: 81.74,41.27
N$133  (via drill 0.8 pad 1.93)
  other vias: 90.64,43.82
N$134  (via drill 0.8 pad 1.93)
  other vias: 94.45,41.27
N$135  (via drill 0.8 pad 1.93)
  other vias: 90.65,36.2
N$136  (via drill 0.8 pad 1.93)
  other vias: 94.46,33.64
N$137  (via drill 0.8 pad 1.93)
  other vias: 93.18,27.93
N$138  (via drill 0.8 pad 1.93)
  other vias: 93.19,25.4
N$139  (via drill 0.8 pad 1.93)
  other vias: 82.38,21.59
N$140  (via drill 0.8 pad 1.93)
  other vias: 95.09,21.59
N$141  (via drill 0.8 pad 1.68)
  other vias: 4.28,20.22
N$142  (via drill 0.8 pad 1.68)
  other vias: 4.27,22.96
N$143  (via drill 0.8 pad 1.68)
  other vias: 16.98,22.96
N$144  (via drill 0.8 pad 1.68)
  other vias: 16.98,20.21
N$145  (via drill 0.8 pad 1.68)
  other vias: 29.67,22.97
N$146  (via drill 0.8 pad 1.68)
  other vias: 29.67,20.2
N$147  (via drill 0.8 pad 1.68)
  other vias: 42.38,23
N$148  (via drill 0.8 pad 1.68)
  other vias: 42.38,20.19
N$149  (via drill 0.8 pad 1.68)
  other vias: 55.07,22.97
N$150  (via drill 0.8 pad 1.68)
  other vias: 55.07,20.19
N$151  (via drill 0.8 pad 1.68)
  other vias: 67.78,20.21
N$152  (via drill 0.8 pad 1.68)
  other vias: 67.77,22.98
N$153  (via drill 0.8 pad 1.93)
  other vias: 69.68,21.6
N$154  (via drill 0.8 pad 1.68)
  other vias: 80.48,22.97
N$155  (via drill 0.8 pad 1.68)
  other vias: 80.49,20.2
N$156  (via drill 0.8 pad 1.68)
  other vias: 93.17,22.98
N$157  (via drill 0.8 pad 1.68)
  other vias: 93.17,20.18
N$158  (via drill 1 pad 2.18)
  other vias: 8.12,12.52
N$159  (via drill 1 pad 2.18)
  other vias: 8.14,17.6
N$160  (via drill 1 pad 2.18)
  other vias: 20.81,12.52
N$161  (via drill 1 pad 2.18)
  other vias: 20.85,17.6
N$162  (via drill 1 pad 2.18)
  other vias: 33.53,17.58
N$163  (via drill 1 pad 2.18)
  other vias: 33.53,12.52
N$164  (via drill 1 pad 2.18)
  other vias: 46.23,12.54
N$165  (via drill 1 pad 2.18)
  other vias: 46.24,17.61
N$166  (via drill 1 pad 2.18)
  other vias: 58.92,12.55
N$167  (via drill 1 pad 2.18)
  other vias: 58.95,17.6
N$168  (via drill 1 pad 2.18)
  other vias: 71.64,17.6
N$169  (via drill 1 pad 2.18)
  other vias: 71.64,12.53
N$170  (via drill 1 pad 2.18)
  other vias: 84.34,12.52
N$171  (via drill 1 pad 2.18)
  other vias: 84.33,17.59
N$172  (via drill 1 pad 2.18)
  other vias: 97.04,17.6
N$173  (via drill 1 pad 2.18)
  other vias: 97.04,12.51
N$174  (via drill 1 pad 2.18)
  other vias: 89.41,25.21
N$175  (via drill 1 pad 2.18)
  other vias: 84.33,27.76
N$176  (via drill 1 pad 2.18)
  other vias: 76.72,25.23
N$177  (via drill 1 pad 2.18)
  other vias: 71.62,27.75
N$178  (via drill 1 pad 2.18)
  other vias: 97.03,27.76
N$179  (via drill 1 pad 2.18)
  other vias: 102.11,25.23
N$180  (via drill 1 pad 2.18)
  other vias: 58.93,27.76
N$181  (via drill 1 pad 2.18)
  other vias: 64.03,25.24
N$182  (via drill 1 pad 2.18)
  other vias: 46.22,27.78
N$183  (via drill 1 pad 2.18)
  other vias: 51.3,25.22
N$184  (via drill 1 pad 2.18)
  other vias: 33.54,27.76
N$185  (via drill 1 pad 2.18)
  other vias: 38.61,25.21
N$186  (via drill 1 pad 2.18)
  other vias: 20.85,27.78
N$187  (via drill 1 pad 2.18)
  other vias: 25.92,25.24
N$188  (via drill 0.8 pad 1.78)
  other vias: 50.03,66.66
N$189  (via drill 0.8 pad 1.78)
  other vias: 49.99,64.12
N$190  (via drill 0.8 pad 1.78)
  other vias: 49.99,61.58
N$191  (via drill 0.8 pad 1.78)
  other vias: 49.99,59.08
N$192  (via drill 0.8 pad 1.78)
  other vias: 50.03,56.5
N$193  (via drill 1 pad 2.18)
  other vias: 8.11,27.76
N$194  (via drill 0.8 pad 1.78)
  other vias: 49.99,54
N$195  (via drill 0.8 pad 1.78)
  other vias: 49.99,51.46
N$196  (via drill 0.8 pad 1.78)
  other vias: 57.57,56.5
N$197  (via drill 0.8 pad 1.78)
  other vias: 57.57,53.96
N$198  (via drill 0.8 pad 1.78)
  other vias: 57.61,51.42
N$199  (via drill 0.8 pad 1.78)
  other vias: 57.61,59.04
N$200  (via drill 0.8 pad 1.78)
  other vias: 50.03,48.92
N$201  (via drill 0.8 pad 1.78)
  other vias: 50.03,46.34
N$202  (via drill 0.8 pad 1.78)
  other vias: 57.61,48.92
N$203  (via drill 0.8 pad 1.78)
  other vias: 57.57,46.34
N$204  (via drill 0.8 pad 1.78)
  other vias: 57.57,61.58
N$205  (via drill 0.8 pad 1.78)
  other vias: 57.61,64.12
N$206  (via drill 0.8 pad 1.78)
  other vias: 57.61,66.7
N$207  (via drill 1 pad 2.18)
  other vias: 13.22,25.22
N$208  (via drill 1 pad 1.93)
  other vias: 13.18,50.16
N$209  (via drill 1 pad 1.93)
  other vias: 13.17,60.33
N$210  (via drill 0.8 pad 1.93)
  other vias: 16.98,56.51
N$211  (via drill 0.8 pad 1.93)
  other vias: 20.76,53.99
N$212  (via drill 0.8 pad 1.93)
  other vias: 36.03,56.51
N$213  (via drill 0.8 pad 1.93)
  other vias: 46.18,56.52
N$214  (via drill 0.8 pad 1.93)
  other vias: 34.75,41.23
N$215  (via drill 0.8 pad 1.93)
  other vias: 47.46,41.27
N$216  (via drill 0.8 pad 1.93)
  other vias: 60.17,41.27
N$217  (via drill 0.8 pad 1.93)
  other vias: 9.39,41.23
N$218  (via drill 0.8 pad 1.93)
  other vias: 22.04,41.23
N$219  (via drill 0.8 pad 1.93)
  other vias: 9.35,31.11
N$220  (via drill 0.8 pad 1.93)
  other vias: 22.06,31.03
N$221  (via drill 0.8 pad 1.93)
  other vias: 34.74,31.06
N$222  (via drill 0.8 pad 1.93)
  other vias: 47.49,31.13
N$223  (via drill 0.8 pad 1.93)
  other vias: 60.13,31.03
N$224  (via drill 0.8 pad 1.93)
  other vias: 72.91,31.06
N$225  (via drill 0.8 pad 1.93)
  other vias: 85.56,31.1
N$226  (via drill 0.8 pad 1.93)
  other vias: 98.23,31.13
N$227  (via drill 0.8 pad 1.93)
  other vias: 98.28,41.27
N$228  (via drill 0.8 pad 1.93)
  other vias: 85.57,41.27
N$229  (via drill 0.8 pad 1.93)
  other vias: 72.87,41.26
N$230  (via drill 0.8 pad 1.93)
  other vias: 90.62,46.71
N$231  (via drill 0.8 pad 1.93)
  other vias: 100.81,46.67
N$232  (via drill 0.8 pad 1.93)
  other vias: 67.8,61.44
N$233  (via drill 0.8 pad 1.93)
  other vias: 67.78,56.64
N$234  (via drill 0.8 pad 1.93)
  other vias: 85.59,65.42
N$235  (via drill 0.8 pad 1.93)
  other vias: 93.21,69.24
N$236
  pour Bottom (isolate 0.51): 0.15,77.15 0.15,-0.01 106.2,-0.01 106.2,77.15

### Text on the board
Bottom: SRE | ENERO | 2009